# EasyEDA Pro project ProPrj_BrainStimulator-4Channels-Prototype_2025-12-16.epro, schematic Battery
Board Name: Board1; Create Date: 2025-11-10; Page Name: P1; Project Name: BrainStimulator-4Channels-Prototype; Schematic Name: Schematic3; Update Date: 2025-11-10; Company: 嘉立创EDA; Page Size: A4; Version: V1.0
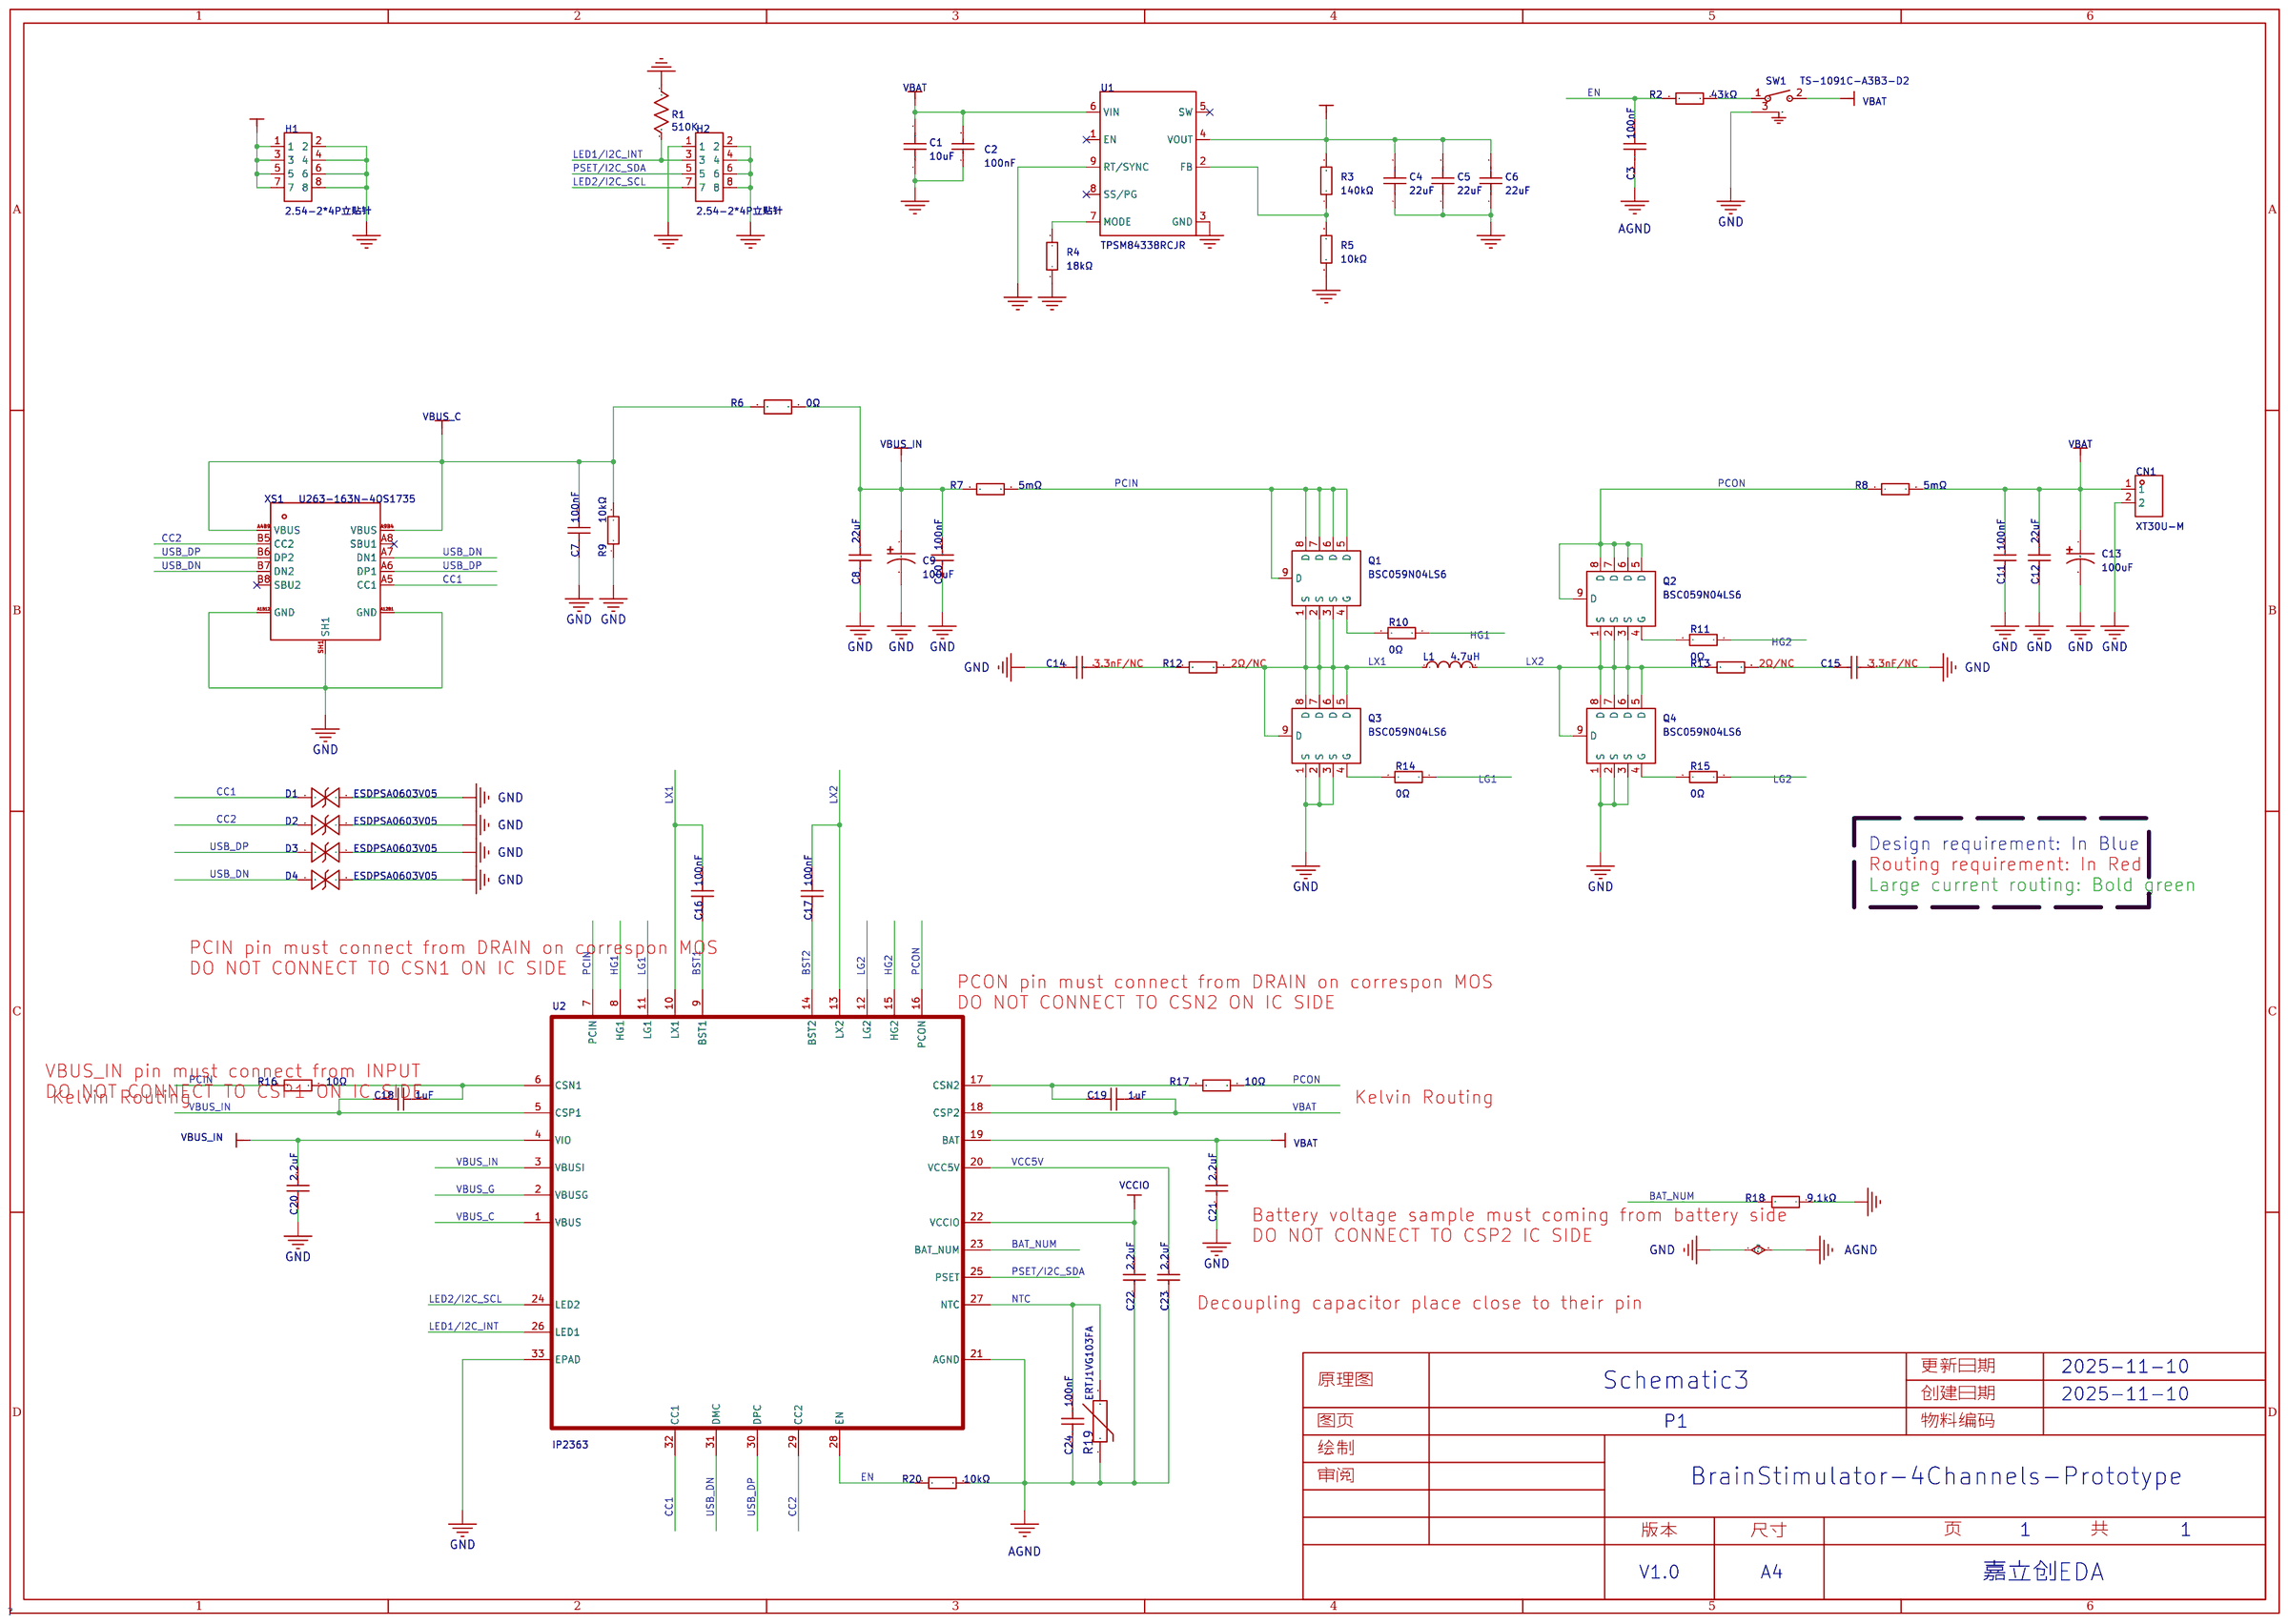
[diagram p0: schematic sheet]

## Parts
C1  10uF  [C0805]
C2  100nF  [C0805]
C3  100nF  [C0603]
C4  22uF  [C0603]
C5  22uF  [C0603]
C6  22uF  [C0603]
C7  100nF  [C0603]
C8  22uF  [C1210]
C9  100uF  [CAP-SMD_BD6.3-L6.6-W6.6-FD]
C10  100nF  [C0805_1]
C11  100nF  [C0805_1]
C12  22uF  [C1210]
C13  100uF  [CAP-SMD_BD6.3-L6.6-W6.6-FD]
C14  3.3nF/NC  [C0603_1]
C15  3.3nF/NC  [C0603_1]
C16  100nF  [C0603]
C17  100nF  [C0603]
C18  1uF  [C0603_1]
C19  1uF  [C0603_1]
C20  2.2uF  [C0603_1]
C21  2.2uF  [C0603_1]
C22  2.2uF  [C0603_1]
C23  2.2uF  [C0603_1]
C24  100nF  [C0603]
CN1  XT30U-M  [CONN-TH_XT30U-M]
D1  ESDPSA0603V05  [D0603-BI]
D2  ESDPSA0603V05  [D0603-BI]
D3  ESDPSA0603V05  [D0603-BI]
D4  ESDPSA0603V05  [D0603-BI]
H1  2.54-2*4P立贴针  [HDR-SMD_8P-P2.54-V-M-R2-C4-LS7.4]
H2  2.54-2*4P立贴针  [HDR-SMD_8P-P2.54-V-M-R2-C4-LS7.4]
L1  4.7uH  [IND-SMD_L10.9-W10.0]
Q1  BSC059N04LS6  [TDSON-8_L6.0-W5.0-P1.27-LS6.2-BL]
Q2  BSC059N04LS6  [TDSON-8_L6.0-W5.0-P1.27-LS6.2-BL]
Q3  BSC059N04LS6  [TDSON-8_L6.0-W5.0-P1.27-LS6.2-BL]
Q4  BSC059N04LS6  [TDSON-8_L6.0-W5.0-P1.27-LS6.2-BL]
R1  510K  [R0603]
R2  43kΩ  [R0603_1]
R3  140kΩ  [R0603]
R4  18kΩ  [R0603]
R5  10kΩ  [R0603]
R6  0Ω  [RES-SMD_L5.2-W1.5]
R7  5mΩ  [R1206]
R8  5mΩ  [R1206]
R9  10kΩ  [R0603]
R10  0Ω  [R0603_1]
R11  0Ω  [R0603_1]
R12  2Ω/NC  [R0603_1]
R13  2Ω/NC  [R0603_1]
R14  0Ω  [R0603_1]
R15  0Ω  [R0603_1]
R16  10Ω  [R0603_1]
R17  10Ω  [R0603_1]
R18  9.1kΩ  [R0603_1]
R19  ERTJ1VG103FA  [R0603_1]
R20  10kΩ  [R0603]
SW1  TS-1091C-A3B3-D2  [SW-SMD_YUANDI_TS-1091C-A3B3-D2]
U1  TPSM84338RCJR  [QFN-FCMOD-9_L4.5-W3.3_TPSM84338]
U2  IP2363  [QFN-32_L5.0-W5.0-P0.50-BL-EP3.4]
XS1  U263-163N-4OS1735  [USB-C-SMD_U263-163N-4GS1735_1]

## Library data of the parts
C1 = GRM21BR61H106KE43L: 容值:10uF;精度:±10%;额定电压:50V;温度系数:X5R;; LCSC Part Name: 10uF ±10% 50V; Supplier Part: C440198; Manufacturer: muRata(村田); Supplier Footprint: 0805; JLCPCB Part Class: Basic Part; Datasheet: https://item.szlcsc.com/datasheet/GRM21BR61H106KE43L/439567.html; Supplier: LCSC; Tolerance: ±10%; Voltage Rating: 50V; Temperature Coefficient: X5R
C2 = CL21B104KBCNNNC: 容值:100nF;精度:±10%;额定电压:50V;温度系数:X7R;; LCSC Part Name: 100nF ±10% 50V; Supplier Part: C1711; Manufacturer: SAMSUNG(三星); Supplier Footprint: 0805; JLCPCB Part Class: Extended Part; Datasheet: https://item.szlcsc.com/datasheet/CL21B104KBCNNNC/2063.html; Supplier: LCSC; Tolerance: ±10%; Voltage Rating: 50V; Temperature Coefficient: X7R
C3 C7 C16 C17 C24 = CC0603KRX7R9BB104: 容值:100nF;精度:±10%;额定电压:50V;材质(温度系数):X7R;; LCSC Part Name: 100nF ±10% 50V; Supplier Part: C14663; Manufacturer: YAGEO(国巨); Supplier Footprint: 0603; JLCPCB Part Class: Basic Part; Datasheet: https://atta.szlcsc.com/upload/public/pdf/source/20180910/C282072_33301C7F631E79921B82A8DAC6BCC5B3.pdf; Supplier: LCSC; Tolerance: ±10%; Voltage Rating: 50V; Temperature Coefficient: X7R; Voltage Rated: 50V
C4-C6 = CL10A226MP8NUNE: 容值:22uF;精度:±20%;额定电压:10V;温度系数:X5R;; LCSC Part Name: 22uF ±20% 10V; Supplier Part: C86295; Manufacturer: SAMSUNG(三星); Supplier Footprint: 0603; JLCPCB Part Class: Extended Part; Datasheet: https://item.szlcsc.com/datasheet/CL10A226MP8NUNE/87471.html; Supplier: LCSC; Tolerance: ±20%; Voltage Rating: 10V; Temperature Coefficient: X5R
C8 C12 = GRM32ER71E226KE15L: 容值:22uF;精度:±10%;额定电压:25V;材质(温度系数):X7R;; LCSC Part Name: 22uF ±10% 25V; Supplier Part: C21397; Manufacturer: muRata(村田); Supplier Footprint: 1210; JLCPCB Part Class: 扩展库; Datasheet: https://atta.szlcsc.com/upload/public/pdf/source/20230811/6AA9DB9766E5496748A2F980D0C94A94.pdf; Supplier: LCSC; Tolerance: ±10%; Voltage Rated: 25V; Temperature Coefficient: X7R
C9 C13 = EEEFTH101XAP: 容值:100uF;精度:±20%;额定电压:50V;纹波电流:350mA@100kHz;等效串联电阻(ESR):340mΩ@100kHz;; LCSC Part Name: 100uF ±20% 50V; Supplier Part: C165974; Manufacturer: PANASONIC(松下); Supplier Footprint: SMD,D6.3xL7.7mm; JLCPCB Part Class: Extended Part; Datasheet: https://item.szlcsc.com/datasheet/EEEFTH101XAP/177357.html; Supplier: LCSC; Tolerance: ±20%; Voltage Rating: 50V; Ripple Current: 350mA@100kHz; Equivalent Series Resistance(ESR): 340mΩ@100kHz; Diameter: 6.3mm; Height - Seated (Max): 8mm; Lifetime: 2000hrs@105℃; Operating Temperature: -55℃~+105℃
C10 C11 = CC0805KRX7R9BB104: 容值:100nF;精度:±10%;额定电压:50V;材质(温度系数):X7R;; LCSC Part Name: 100nF ±10% 50V; Supplier Part: C49678; Manufacturer: YAGEO(国巨); Supplier Footprint: 0805; JLCPCB Part Class: 基础库; Datasheet: https://atta.szlcsc.com/upload/public/pdf/source/20180224/C181747_15194369449651363981.pdf; Supplier: LCSC; Tolerance: ±10%; Voltage Rated: 50V; Temperature Coefficient: X7R
C14 C15 = CL10B332KB8NNNC: 容值:3.3nF;精度:±10%;额定电压:50V;材质(温度系数):X7R;; LCSC Part Name: 3.3nF ±10% 50V; Supplier Part: C1613; Manufacturer: SAMSUNG(三星); Supplier Footprint: 0603; JLCPCB Part Class: 基础库; Datasheet: https://atta.szlcsc.com/upload/public/pdf/source/20160218/1457707763339.pdf; Supplier: LCSC; Tolerance: ±10%; Voltage Rated: 50V; Temperature Coefficient: X7R
C18 C19 = CL10A105KB8NNNC: 容值:1uF;精度:±10%;额定电压:50V;材质(温度系数):X5R;; LCSC Part Name: 1uF ±10% 50V; Supplier Part: C15849; Manufacturer: SAMSUNG(三星); Supplier Footprint: 0603; JLCPCB Part Class: 基础库; Datasheet: https://atta.szlcsc.com/upload/public/pdf/source/20160218/1457707763339.pdf; Supplier: LCSC; Tolerance: ±10%; Voltage Rated: 50V; Temperature Coefficient: X5R
C20 C21 = 0603B225K250NT: 容值:2.2uF;精度:±10%;额定电压:25V;材质(温度系数):X7R;; LCSC Part Name: 2.2uF ±10% 25V; Supplier Part: C99228; Manufacturer: FH(风华); Supplier Footprint: 0603; JLCPCB Part Class: 扩展库; Datasheet: https://atta.szlcsc.com/upload/public/pdf/source/20200305/C486355_26A10D38EF8C2A5C37091D0039909270.pdf; Supplier: LCSC; Tolerance: ±10%; Voltage Rated: 25V; Temperature Coefficient: X7R
C22 C23 = CL10A225KO8NNNC: 容值:2.2uF;精度:±10%;额定电压:16V;材质(温度系数):X5R;; LCSC Part Name: 2.2uF ±10% 16V; Supplier Part: C23630; Manufacturer: SAMSUNG(三星); Supplier Footprint: 0603; JLCPCB Part Class: 基础库; Datasheet: https://atta.szlcsc.com/upload/public/pdf/source/20160218/1457707763339.pdf; Supplier: LCSC; Tolerance: ±10%; Voltage Rated: 16V; Temperature Coefficient: X5R
CN1 = XT30U-M: 类别:-;类型1:-;; LCSC Part Name: AMASS(艾迈斯)轻量版锂电池插头公头 XT30U-M; Supplier Part: C99101; Manufacturer: AMASS(艾迈斯); JLCPCB Part Class: Extended Part; Datasheet: https://item.szlcsc.com/datasheet/XT30U-M/100314.html; Supplier: LCSC; Type: 插头; Colour: 黄色; InterfaceType: 公头
D1-D4 = ESDPSA0603V05: 极性:双向;反向截止电压(Vrwm):5V;最大钳位电压:35V;; Supplier Part: C2900816; Manufacturer: Semitel(晶讯); Supplier Footprint: 0603; JLCPCB Part Class: 扩展库; Datasheet: https://atta.szlcsc.com/upload/public/pdf/source/20210926/C157A6DC6F0101425B85D310EF0A1428.pdf; Supplier: LCSC; polarity: 双向; Reverse Stand-Off Voltage (Vrwm): 5V; Maximum Clamping Voltage: 35V; Number of Lines: 单路; Operating Temperature: -55℃~+125℃; Type: ESD
H1 H2 = 2.54-2*4P立贴针: 插针结构:2x4P;间距:2.54mm;行距:2.54mm;圆针/方针:方针;安装方式:立贴;排数:双排;总PIN位数:8P;额定电流:3A;额定电压:-;配合针长度:6mm;塑高:2.5mm;端接针长度:-;触头材质:-;触头镀层:-;工作温度:-55℃~+105℃;颜色:黑色;; LCSC Part Name: 2x4P 间距:2.54mm 方针 立贴; Supplier Part: C192300; Manufacturer: BOOMELE(博穆精密); Supplier Footprint: SMD,P=2.54mm; JLCPCB Part Class: Extended Part; Datasheet: https://item.szlcsc.com/datasheet/2.54-2*4P%25E7%25AB%258B%25E8%25B4%25B4%25E9%2592%2588/221271.html; Supplier: LCSC; Pin Structure: 2x4P; Pitch: 2.54mm; Row Spacing: 2.54mm; Circluar Pins/Square Pins: 方针; Mounting Type: 立贴; Number of Rows: 双排; Number of Pins: 8P; Current Rating: 3A; Length of Mating Pin: 6mm; Insulation Height: 2.5mm; Operating Temperature: -55℃~+105℃; Color: 黑色
L1 = ETQP6M4R7YLC: 电感值:4.7uH;精度:±20%;额定电流:11.8A;类型:一体成型电感;; LCSC Part Name: 4.7uH ±20%; Supplier Part: C409643; Manufacturer: PANASONIC(松下); Supplier Footprint: SMD; JLCPCB Part Class: 扩展库; Datasheet: https://atta.szlcsc.com/upload/public/pdf/source/20190806/C409643_EEE3F0D2849D06837D605D0504463401.pdf; Supplier: LCSC; Tolerance: ±20%; Rated Current: 11.8A; DC Resistance (DCR): 8.7mΩ; Type: 一体成型电感; Ratings: AEC-Q200
Q1-Q4 = BSC059N04LS6: 数量:1个N沟道;漏源电压(Vdss):40V;连续漏极电流(Id):59A;导通电阻(RDS(on)):5.9mΩ@10V,50A;耗散功率(Pd):38W;阈值电压(Vgs(th)):2.3V;; LCSC Part Name: 1个N沟道 耐压:40V 电流:59A; Supplier Part: C534356; Manufacturer: Infineon(英飞凌); Supplier Footprint: TDSON-8FL; JLCPCB Part Class: Extended Part; Datasheet: https://item.szlcsc.com/datasheet/BSC059N04LS6/554740.html; Supplier: LCSC; Number: 1个N沟道; Drain to Source Voltage: 40V; Current - Continuous Drain(Id): 59A; RDS(on): 5.9mΩ@10V,50A; Pd - Power Dissipation: 38W; Gate Threshold Voltage (Vgs(th)): 2.3V; Gate Charge(Qg): 9.4nC@10V; Input Capacitance(Ciss): 830pF@20V; Reverse Transfer Capacitance (Crss@Vds): 21pF@20V; Operating Temperature: -55℃~+175℃
R1 = 510K: nameAlias: Value(Ω); Contributor: LCEDA_Lib; spicePre: R; spiceSymbolName: R_0603_US
R2 = 0603WAF4302T5E: 电阻类型:厚膜电阻;阻值:43kΩ;精度:±1%;功率:100mW;最大工作电压:75V;温度系数:±100ppm/℃;; LCSC Part Name: 43kΩ ±1% 100mW 厚膜电阻; Supplier Part: C23172; Manufacturer: UNI-ROYAL(厚声); Supplier Footprint: 0603; JLCPCB Part Class: 扩展库; Datasheet: https://atta.szlcsc.com/upload/public/pdf/source/20200306/C422600_1E6D84923E4A46A82E41ADD87F860B5C.pdf; Supplier: LCSC; Type: 厚膜电阻; Tolerance: ±1%; Power(Watts): 100mW; Overload Voltage (Max): 75V; Temperature Coefficient: ±100ppm/℃; Operating Temperature Range: -55℃~+155℃
R3 = RC0603FR-07140KL: 电阻类型:厚膜电阻;阻值:140kΩ;精度:±1%;功率:100mW;工作电压:75V;温度系数:±100ppm/℃;; LCSC Part Name: 厚膜电阻 140kΩ ±1% 100mW; Supplier Part: C185372; Manufacturer: YAGEO(国巨); Supplier Footprint: 0603; JLCPCB Part Class: Extended Part; Datasheet: https://item.szlcsc.com/datasheet/RC0603FR-07140KL/196777.html; Supplier: LCSC; Type: 厚膜电阻; Tolerance: ±1%; Power(Watts): 100mW; Voltage-Supply(Max): 75V; Temperature Coefficient: ±100ppm/℃; Operating Temperature: -55℃~+155℃
R4 = RC0603FR-0718KL: 电阻类型:厚膜电阻;阻值:18kΩ;精度:±1%;功率:100mW;工作电压:75V;温度系数:±100ppm/℃;; LCSC Part Name: 厚膜电阻 18kΩ ±1% 100mW; Supplier Part: C114610; Manufacturer: YAGEO(国巨); Supplier Footprint: 0603; JLCPCB Part Class: Extended Part; Datasheet: https://item.szlcsc.com/datasheet/RC0603FR-0718KL/115854.html; Supplier: LCSC; Type: 厚膜电阻; Tolerance: ±1%; Power(Watts): 100mW; Voltage-Supply(Max): 75V; Temperature Coefficient: ±100ppm/℃; Operating Temperature: -55℃~+155℃
R5 = RC0603FR-0710KL: 电阻类型:厚膜电阻;阻值:10kΩ;精度:±1%;功率:100mW;最大工作电压:75V;温度系数:±100ppm/℃;; LCSC Part Name: 厚膜电阻 10kΩ ±1% 100mW; Supplier Part: C98220; Manufacturer: YAGEO(国巨); Supplier Footprint: 0603; JLCPCB Part Class: Extended Part; Datasheet: https://atta.szlcsc.com/upload/public/pdf/source/20180927/C295883_E8D83085EA81BD7DE0B2B681138C15EE.pdf; Supplier: LCSC; Type: 厚膜电阻; Tolerance: ±1%; Power(Watts): 100mW; Overload Voltage (Max): 75V; Temperature Coefficient: ±100ppm/℃; Operating Temperature Range: -55℃~+155℃
R6 = HOT(0.4*1.5)-5.2-0R-I: 阻值:0Ω;功率:-;; Supplier Part: C500754; Manufacturer: Milliohm(毫欧); Supplier Footprint: SMD,1.5x5.2mm; JLCPCB Part Class: 扩展库; Datasheet: https://atta.szlcsc.com/upload/public/pdf/source/20200326/C500753_6DCE47273401DD5E7FB7D709394B6FEB.pdf; Supplier: LCSC
R7 R8 = RLM12FTCMR005: 阻值:5mΩ;精度:±1%;功率:1W;温度系数:±100ppm/℃;; LCSC Part Name: 5mΩ ±1% 1W; Supplier Part: C316225; Manufacturer: 大毅科技; Supplier Footprint: 1206; JLCPCB Part Class: 扩展库; Datasheet: https://atta.szlcsc.com/upload/public/pdf/source/20181023/C316226_D363EC3D88B44FBEE1B74F4A1DF43EB9.pdf; Supplier: LCSC; Tolerance: ±1%; Power(Watts): 1W; Temperature Coefficient: ±100ppm/℃
R9 = 0603WAF1002T5E: 电阻类型:厚膜电阻;阻值:10kΩ;精度:±1%;功率:100mW;最大工作电压:75V;温度系数:±100ppm/℃;; LCSC Part Name: 厚膜电阻 10kΩ ±1% 100mW; Supplier Part: C25804; Manufacturer: UNI-ROYAL(厚声); Supplier Footprint: 0603; JLCPCB Part Class: Basic Part; Datasheet: https://atta.szlcsc.com/upload/public/pdf/source/20200306/C422600_1E6D84923E4A46A82E41ADD87F860B5C.pdf; Supplier: LCSC; Type: 厚膜电阻; Tolerance: ±1%; Power(Watts): 100mW; Voltage-Supply(Max): 75V; Temperature Coefficient: ±100ppm/℃; Operating Temperature: -55℃~+155℃; Overload Voltage (Max): 75V; Operating Temperature Range: -55℃~+155℃
R10 R11 R14 R15 = 0603WAF0000T5E: 电阻类型:厚膜电阻;阻值:0Ω;精度:±1%;功率:100mW;最大工作电压:75V;; LCSC Part Name: 0Ω ±1% 100mW 厚膜电阻; Supplier Part: C21189; Manufacturer: UNI-ROYAL(厚声); Supplier Footprint: 0603; JLCPCB Part Class: 基础库; Datasheet: https://atta.szlcsc.com/upload/public/pdf/source/20200306/C422600_1E6D84923E4A46A82E41ADD87F860B5C.pdf; Supplier: LCSC; Type: 厚膜电阻; Tolerance: ±1%; Power(Watts): 100mW; Overload Voltage (Max): 75V; Operating Temperature Range: -55℃~+155℃
R12 R13 = 0603WAF200KT5E: 电阻类型:厚膜电阻;阻值:2Ω;精度:±1%;功率:100mW;最大工作电压:75V;温度系数:±200ppm/℃;; LCSC Part Name: 2Ω ±1% 100mW 厚膜电阻; Supplier Part: C22977; Manufacturer: UNI-ROYAL(厚声); Supplier Footprint: 0603; JLCPCB Part Class: 基础库; Datasheet: https://atta.szlcsc.com/upload/public/pdf/source/20200306/C422600_1E6D84923E4A46A82E41ADD87F860B5C.pdf; Supplier: LCSC; Type: 厚膜电阻; Tolerance: ±1%; Power(Watts): 100mW; Overload Voltage (Max): 75V; Temperature Coefficient: ±200ppm/℃; Operating Temperature Range: -55℃~+155℃
R16 R17 = 0603WAF100JT5E: 电阻类型:厚膜电阻;阻值:10Ω;精度:±1%;功率:100mW;最大工作电压:75V;温度系数:±400ppm/℃;; LCSC Part Name: 10Ω ±1% 100mW 厚膜电阻; Supplier Part: C22859; Manufacturer: UNI-ROYAL(厚声); Supplier Footprint: 0603; JLCPCB Part Class: 基础库; Datasheet: https://atta.szlcsc.com/upload/public/pdf/source/20200306/C422600_1E6D84923E4A46A82E41ADD87F860B5C.pdf; Supplier: LCSC; Type: 厚膜电阻; Tolerance: ±1%; Power(Watts): 100mW; Overload Voltage (Max): 75V; Temperature Coefficient: ±400ppm/℃; Operating Temperature Range: -55℃~+155℃
R18 = 0603WAF9101T5E: 电阻类型:厚膜电阻;阻值:9.1kΩ;精度:±1%;功率:100mW;最大工作电压:75V;温度系数:±100ppm/℃;; LCSC Part Name: 9.1kΩ ±1% 100mW 厚膜电阻; Supplier Part: C23260; Manufacturer: UNI-ROYAL(厚声); Supplier Footprint: 0603; JLCPCB Part Class: 基础库; Datasheet: https://atta.szlcsc.com/upload/public/pdf/source/20200306/C422600_1E6D84923E4A46A82E41ADD87F860B5C.pdf; Supplier: LCSC; Type: 厚膜电阻; Tolerance: ±1%; Power(Watts): 100mW; Overload Voltage (Max): 75V; Temperature Coefficient: ±100ppm/℃; Operating Temperature Range: -55℃~+155℃
R19 = ERTJ1VG103FA: 阻值(25℃):10kΩ;B值(25℃/50℃):3380K;电阻精度:±1%;功率:100mW;B值精度:±1%;最大稳态电流(25℃):-;; LCSC Part Name: 10kΩ 电阻精度:±1% 3380K; Supplier Part: C153011; Manufacturer: PANASONIC(松下); Supplier Footprint: 0603; JLCPCB Part Class: 扩展库; Datasheet: https://atta.szlcsc.com/upload/public/pdf/source/20180420/C178739_3B90639CA07E4EB840BCF39529957312.pdf; Supplier: LCSC; Resistance @ 25℃: 10kΩ; B Constant (25℃/50℃): 3380K; Resistance Tolerance: ±1%; B Constant (25℃/85℃): 3435K; Power: 100mW; B Constant Tolerance: ±1%; Operating Temperature: -40℃~+125℃
R20 = 0603WAF1002T5E: 阻值:10kΩ;精度:±1%;功率:100mW;温度系数:±100ppm/℃;电阻类型:厚膜电阻;; LCSC Part Name: 10kΩ ±1% 100mW 厚膜电阻; Supplier Part: C25804; Manufacturer: UNI-ROYAL(厚声); Supplier Footprint: 0603; JLCPCB Part Class: Basic Part; Datasheet: https://atta.szlcsc.com/upload/public/pdf/source/20200306/C422600_1E6D84923E4A46A82E41ADD87F860B5C.pdf; Supplier: LCSC; Type: 厚膜电阻; Tolerance: ±1%; Power(Watts): 100mW; Voltage-Supply(Max): 75V; Temperature Coefficient: ±100ppm/℃; Operating Temperature: -55℃~+155℃; Overload Voltage (Max): 75V; Operating Temperature Range: -55℃~+155℃
SW1 = TS-1091C-A3B3-D2: 电路结构:单刀单掷;按钮形状:圆形按钮;作用力:250gf;安装方式:卧贴;开关长度:4.5mm;开关宽度:4.5mm;开关高度:4.5mm;带支架:不带;机械寿命:-;; LCSC Part Name: 4.5*4.5*4.5mm 卧贴 轻触开关; Supplier Part: C2874583; Manufacturer: Yuandi(元迪); Supplier Footprint: SMD; JLCPCB Part Class: 扩展库; Datasheet: https://atta.szlcsc.com/upload/public/pdf/source/20210810/B277025B7122E19697AACD3EBCC3E94D.pdf; Supplier: LCSC; Circuit: 单刀单掷; Actuator Style: 圆形按钮; Operating Force: 250gf; Mounting Style: 卧贴; Switch Length: 4.5mm; Switch Width: 4.5mm; Switch Height: 4.5mm; Strike Gundam: 不带; Actuator/Cap Color: 黑色; Pin Style: SMD接片
U1 = TPSM84338RCJR_C47122151: 是一种高效、高电压输入、易于使用的同步降压电源模块，具有高度的设计灵活性。其工作输入电压范围为3.8V至28V，适用于由5V、12V、19V、24V电源总线轨供电的系统。该设备支持高达3A的连续输出电流和98%的最大占空比。使用带内部补偿的固定频率峰值电流控制，以实现快速瞬态响应和良好的线路及负载调节; Supplier Part: C47122151; Manufacturer: TI(德州仪器); Supplier Footprint: QFN-FCMOD-9; JLCPCB Part Class: Extended Part; Datasheet: https://www.ti.com.cn/cn/lit/ds/symlink/tpsm84338.pdf; Supplier: LCSC
U2 = IP2363_1
XS1 = U263-163N-4OS1735: 连接器类型:Type-C;标准:USB 3.1;公母:母;端口数量:1;触点数量:16P;安装方式:卧贴;额定电流 - 电源:5A;触头材质:铜合金;触头镀层:金;工作温度范围:-25℃~+85℃;焊接温度(最大值):260℃;; LCSC Part Name: Type-C 母 卧贴; Supplier Part: C2931472; Manufacturer: XKB Connection(中国星坤); Supplier Footprint: SMD; JLCPCB Part Class: 扩展库; Datasheet: https://atta.szlcsc.com/upload/public/pdf/source/20211215/D777AAC9FA67A227A25094451B68E75F.pdf; Supplier: LCSC; Connector Type: Type-C; Standard: USB 3.1; Gender: 母; Number of Ports: 1; Number of Contacts: 16P; Mounting Style: 卧贴; Current Rating - Power (Max): 5A; Contact Material: 铜合金; Contact Plating: 金; Operating Temperature Range: -25℃~+85℃; Soldering Temperature(Max): 260℃

## Nets
9V: C4.2 C5.2 C6.2 H1.1 H1.3 H1.5 H1.7 R3.2 U1.4(VOUT)
AGND: C1.1 C2.1 C3.2 C4.1 C5.1 C6.1 C7.1 C8.1 C9.2 C10.1 C11.1 C12.1 C13.2 C14.1 C15.2 C20.2 C21.2 C22.1 C23.1 C24.1 CN1.2 D1.2 D2.2 D3.2 D4.2 H1.2 H1.4 H1.6 H1.8 H2.1 H2.2 H2.4 H2.6 H2.8 Q3.1(S) Q3.2(S) Q3.3(S) Q4.1(S) Q4.2(S) Q4.3(S) R1.1 R4.1 R5.1 R9.1 R18.1 R19.1 R20.2 SW1.3(GND) U1.3(GND) U1.9(RT/SYNC) U2.21(AGND) U2.33(EPAD) XS1.A1B12(GND) XS1.A12B1(GND) XS1.SH1
VBAT: C1.2 C2.2 C11.2 C12.2 C13.1 C19.2 C21.1 CN1.1 R8.2 SW1.2 U1.6(VIN) U2.18(CSP2) U2.19(BAT)
VBUS_C: C7.2 R6.1 R9.2 U2.1(VBUS) XS1.A4B9(VBUS) XS1.A9B4(VBUS)
VBUS_G: U2.2(VBUSG)
VBUS_IN: C8.2 C9.1 C10.2 C18.1 C20.1 R6.2 R7.1 U2.3(VBUSI) U2.4(VIO) U2.5(CSP1)
VCC5V: C23.2 U2.20(VCC5V)
VCCIO: C22.2 U2.22(VCCIO)
BAT_NUM: R18.2 U2.23(BAT_NUM)
BST1: C16.1 U2.9(BST1)
BST2: C17.1 U2.14(BST2)
CC1: D1.1 U2.32(CC1) XS1.A5(CC1)
CC2: D2.1 U2.29(CC2) XS1.B5(CC2)
EN: C3.1 R2.1 R20.1 U2.28(EN)
HG1: R10.1 U2.8(HG1)
HG2: R11.1 U2.15(HG2)
LED1/I2C_INT: H2.3 R1.2 U2.26(LED1)
LED2/I2C_SCL: H2.7 U2.24(LED2)
LG1: R14.1 U2.11(LG1)
LG2: R15.1 U2.12(LG2)
LX1: C16.2 L1.1 Q1.1(S) Q1.2(S) Q1.3(S) Q3.5(D) Q3.6(D) Q3.7(D) Q3.8(D) Q3.9(D) R12.2 U2.10(LX1)
LX2: C17.2 L1.2 Q2.1(S) Q2.2(S) Q2.3(S) Q4.5(D) Q4.6(D) Q4.7(D) Q4.8(D) Q4.9(D) R13.1 U2.13(LX2)
NTC: C24.2 R19.2 U2.27(NTC)
PCIN: Q1.5(D) Q1.6(D) Q1.7(D) Q1.8(D) Q1.9(D) R7.2 R16.1 U2.7(PCIN)
PCON: Q2.5(D) Q2.6(D) Q2.7(D) Q2.8(D) Q2.9(D) R8.1 R17.1 U2.16(PCON)
PSET/I2C_SDA: H2.5 U2.25(PSET)
USB_DN: D4.1 U2.31(DMC) XS1.A7(DN1) XS1.B7(DN2)
USB_DP: D3.1 U2.30(DPC) XS1.A6(DP1) XS1.B6(DP2)
$1N219: R3.1 R5.2 U1.2(FB)
$1N225: R4.2 U1.7(MODE)
$1N308: C19.1 R17.2 U2.17(CSN2)
$1N311: C18.2 R16.2 U2.6(CSN1)
$1N313: C15.1 R13.2
$1N316: C14.2 R12.1
$1N319: Q4.4(G) R15.2
$1N321: Q2.4(G) R11.2
$1N323: Q3.4(G) R14.2
$1N325: Q1.4(G) R10.2
$1N345: R2.2 SW1.1

Not connected (* = marked no-connect by the designer): U1 1(EN)* 5(SW)* 8(SS/PG)*; XS1 A8(SBU1)* B8(SBU2)*

## Notes on the sheet
- Design requirement: In Blue
- Routing requirement: In Red
- Large current routing: Bold green
- PCIN pin must connect from DRAIN on correspon MOS
  DO NOT CONNECT TO CSN1 ON IC SIDE
- PCON pin must connect from DRAIN on correspon MOS
  DO NOT CONNECT TO CSN2 ON IC SIDE
- VBUS_IN pin must connect from INPUT
  DO NOT CONNECT TO CSP1 ON IC SIDE
- Kelvin Routing
- Kelvin Routing
- Battery voltage sample must coming from battery side
  DO NOT CONNECT TO CSP2 IC SIDE
- Decoupling capacitor place close to their pin
